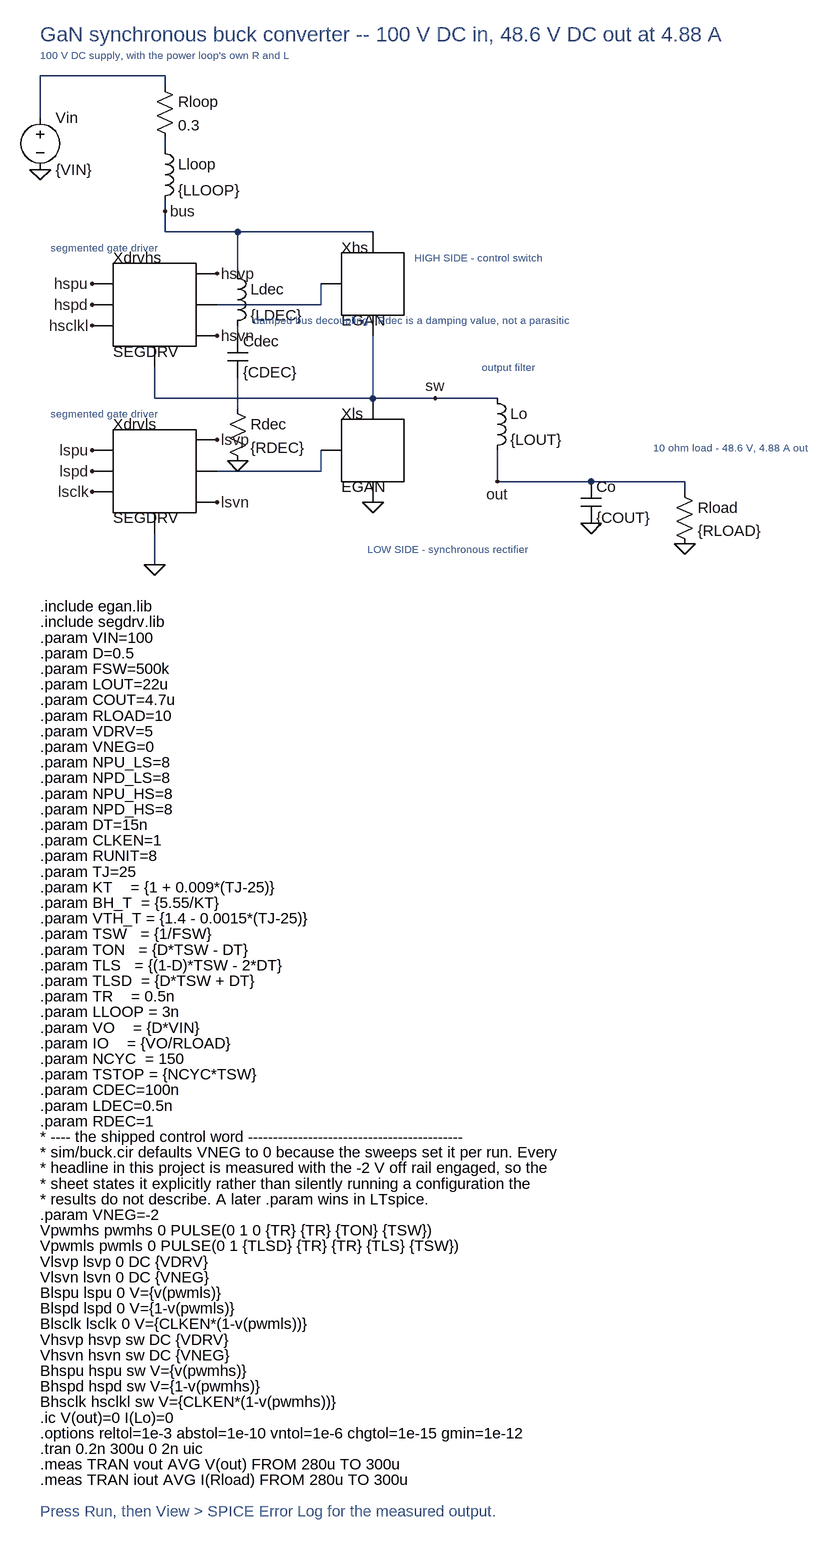
[diagram p0: schematic BUCK_converter.asc]
BUCK_converter.asc, the LTspice schematic file:
Version 4
SHEET 1 2100 1400
SYMBOL voltage 96 192 R0
SYMATTR InstName Vin
SYMATTR Value {VIN}
FLAG 96 288 0
WIRE 96 208 96 144
WIRE 96 144 288 144
SYMBOL res 272 144 R0
SYMATTR InstName Rloop
SYMATTR Value 0.3
WIRE 288 144 288 160
SYMBOL ind 272 240 R0
SYMATTR InstName Lloop
SYMATTR Value {LLOOP}
WIRE 288 240 288 256
WIRE 288 336 288 384
FLAG 288 352 bus
SYMBOL ind 384 432 R0
SYMATTR InstName Ldec
SYMATTR Value {LDEC}
WIRE 400 384 400 448
SYMBOL cap 384 544 R0
SYMATTR InstName Cdec
SYMATTR Value {CDEC}
WIRE 400 528 400 544
SYMBOL res 384 640 R0
SYMATTR InstName Rdec
SYMATTR Value {RDEC}
WIRE 400 608 400 656
FLAG 400 736 0
TEXT 424 520 Left 1 ;damped bus decoupling - Rdec is a damping value, not a parasitic
SYMBOL egan 560 416 R0
SYMATTR InstName Xhs
WIRE 288 384 608 384
WIRE 608 544 608 640
SYMBOL egan 560 672 R0
SYMATTR InstName Xls
WIRE 608 640 608 640
FLAG 608 800 0
WIRE 608 640 800 640
FLAG 704 640 sw
SYMBOL ind 784 624 R0
SYMATTR InstName Lo
SYMATTR Value {LOUT}
WIRE 800 720 800 768
WIRE 800 768 1088 768
FLAG 800 768 out
SYMBOL cap 928 768 R0
SYMATTR InstName Co
SYMATTR Value {COUT}
FLAG 944 832 0
SYMBOL res 1072 768 R0
SYMATTR InstName Rload
SYMATTR Value {RLOAD}
WIRE 1088 768 1088 784
FLAG 1088 864 0
SYMBOL segdrv 208 432 R0
SYMATTR InstName Xdrvhs
SYMATTR Value2 npu={NPU_HS} npd={NPD_HS} runit={RUNIT} rclamp=0.5
WIRE 368 496 528 496
WIRE 528 496 528 464
FLAG 176 464 hspu
FLAG 176 496 hspd
FLAG 176 528 hsclkl
FLAG 368 448 hsvp
FLAG 368 544 hsvn
WIRE 272 592 272 640
WIRE 272 640 608 640
SYMBOL segdrv 208 688 R0
SYMATTR InstName Xdrvls
SYMATTR Value2 npu={NPU_LS} npd={NPD_LS} runit={RUNIT} rclamp=0.5
WIRE 368 752 528 752
WIRE 528 752 528 720
FLAG 176 720 lspu
FLAG 176 752 lspd
FLAG 176 784 lsclk
FLAG 368 704 lsvp
FLAG 368 800 lsvn
WIRE 272 848 272 896
FLAG 272 896 0
TEXT 96 80 Left 3 ;GaN synchronous buck converter -- 100 V DC in, 48.6 V DC out at 4.88 A
TEXT 96 112 Left 1 ;100 V DC supply, with the power loop's own R and L
TEXT 672 424 Left 1 ;HIGH SIDE - control switch
TEXT 600 872 Left 1 ;LOW SIDE - synchronous rectifier
TEXT 776 592 Left 1 ;output filter
TEXT 1040 716 Left 1 ;10 ohm load - 48.6 V, 4.88 A out
TEXT 112 408 Left 1 ;segmented gate driver
TEXT 112 664 Left 1 ;segmented gate driver
TEXT 96 960 Left 2 !.include egan.lib
TEXT 96 984 Left 2 !.include segdrv.lib
TEXT 96 1008 Left 2 !.param VIN=100
TEXT 96 1032 Left 2 !.param D=0.5
TEXT 96 1056 Left 2 !.param FSW=500k
TEXT 96 1080 Left 2 !.param LOUT=22u
TEXT 96 1104 Left 2 !.param COUT=4.7u
TEXT 96 1128 Left 2 !.param RLOAD=10
TEXT 96 1152 Left 2 !.param VDRV=5
TEXT 96 1176 Left 2 !.param VNEG=0
TEXT 96 1200 Left 2 !.param NPU_LS=8
TEXT 96 1224 Left 2 !.param NPD_LS=8
TEXT 96 1248 Left 2 !.param NPU_HS=8
TEXT 96 1272 Left 2 !.param NPD_HS=8
TEXT 96 1296 Left 2 !.param DT=15n
TEXT 96 1320 Left 2 !.param CLKEN=1
TEXT 96 1344 Left 2 !.param RUNIT=8
TEXT 96 1368 Left 2 !.param TJ=25
TEXT 96 1392 Left 2 !.param KT    = {1 + 0.009*(TJ-25)}
TEXT 96 1416 Left 2 !.param BH_T  = {5.55/KT}
TEXT 96 1440 Left 2 !.param VTH_T = {1.4 - 0.0015*(TJ-25)}
TEXT 96 1464 Left 2 !.param TSW   = {1/FSW}
TEXT 96 1488 Left 2 !.param TON   = {D*TSW - DT}
TEXT 96 1512 Left 2 !.param TLS   = {(1-D)*TSW - 2*DT}
TEXT 96 1536 Left 2 !.param TLSD  = {D*TSW + DT}
TEXT 96 1560 Left 2 !.param TR    = 0.5n
TEXT 96 1584 Left 2 !.param LLOOP = 3n
TEXT 96 1608 Left 2 !.param VO    = {D*VIN}
TEXT 96 1632 Left 2 !.param IO    = {VO/RLOAD}
TEXT 96 1656 Left 2 !.param NCYC  = 150
TEXT 96 1680 Left 2 !.param TSTOP = {NCYC*TSW}
TEXT 96 1704 Left 2 !.param CDEC=100n
TEXT 96 1728 Left 2 !.param LDEC=0.5n
TEXT 96 1752 Left 2 !.param RDEC=1
TEXT 96 1776 Left 2 !* ---- the shipped control word -------------------------------------------
TEXT 96 1800 Left 2 !* sim/buck.cir defaults VNEG to 0 because the sweeps set it per run. Every
TEXT 96 1824 Left 2 !* headline in this project is measured with the -2 V off rail engaged, so the
TEXT 96 1848 Left 2 !* sheet states it explicitly rather than silently running a configuration the
TEXT 96 1872 Left 2 !* results do not describe. A later .param wins in LTspice.
TEXT 96 1896 Left 2 !.param VNEG=-2
TEXT 96 1920 Left 2 !Vpwmhs pwmhs 0 PULSE(0 1 0 {TR} {TR} {TON} {TSW})
TEXT 96 1944 Left 2 !Vpwmls pwmls 0 PULSE(0 1 {TLSD} {TR} {TR} {TLS} {TSW})
TEXT 96 1968 Left 2 !Vlsvp lsvp 0 DC {VDRV}
TEXT 96 1992 Left 2 !Vlsvn lsvn 0 DC {VNEG}
TEXT 96 2016 Left 2 !Blspu lspu 0 V={v(pwmls)}
TEXT 96 2040 Left 2 !Blspd lspd 0 V={1-v(pwmls)}
TEXT 96 2064 Left 2 !Blsclk lsclk 0 V={CLKEN*(1-v(pwmls))}
TEXT 96 2088 Left 2 !Vhsvp hsvp sw DC {VDRV}
TEXT 96 2112 Left 2 !Vhsvn hsvn sw DC {VNEG}
TEXT 96 2136 Left 2 !Bhspu hspu sw V={v(pwmhs)}
TEXT 96 2160 Left 2 !Bhspd hspd sw V={1-v(pwmhs)}
TEXT 96 2184 Left 2 !Bhsclk hsclkl sw V={CLKEN*(1-v(pwmhs))}
TEXT 96 2208 Left 2 !.ic V(out)=0 I(Lo)=0
TEXT 96 2232 Left 2 !.options reltol=1e-3 abstol=1e-10 vntol=1e-6 chgtol=1e-15 gmin=1e-12
TEXT 96 2256 Left 2 !.tran 0.2n 300u 0 2n uic
TEXT 96 2280 Left 2 !.meas TRAN vout AVG V(out) FROM 280u TO 300u
TEXT 96 2304 Left 2 !.meas TRAN iout AVG I(Rload) FROM 280u TO 300u
TEXT 96 2352 Left 2 ;Press Run, then View > SPICE Error Log for the measured output.

The netlist it stands for:
* BUCK_converter.asc
Vin N001 0 {VIN}
Rloop N001 N002 0.3
Lloop N002 bus {LLOOP}
Ldec bus N003 {LDEC}
Cdec N003 N004 {CDEC}
Rdec N004 0 {RDEC}
XXhs bus N005 sw EGAN  ; pins d g s
XXls sw N006 0 EGAN  ; pins d g s
Lo sw out {LOUT}
Co out 0 {COUT}
Rload out 0 {RLOAD}
XXdrvhs hspu hspd hsclkl N005 hsvp hsvn sw SEGDRV npu={NPU_HS} npd={NPD_HS} runit={RUNIT} rclamp=0.5  ; pins pu pd clk out vp vn ref
XXdrvls lspu lspd lsclk N006 lsvp lsvn 0 SEGDRV npu={NPU_LS} npd={NPD_LS} runit={RUNIT} rclamp=0.5  ; pins pu pd clk out vp vn ref
* damped bus decoupling - Rdec is a damping value, not a parasitic
* GaN synchronous buck converter -- 100 V DC in, 48.6 V DC out at 4.88 A
* 100 V DC supply, with the power loop's own R and L
* HIGH SIDE - control switch
* LOW SIDE - synchronous rectifier
* output filter
* 10 ohm load - 48.6 V, 4.88 A out
* segmented gate driver
* segmented gate driver
.include egan.lib
.include segdrv.lib
.param VIN=100
.param D=0.5
.param FSW=500k
.param LOUT=22u
.param COUT=4.7u
.param RLOAD=10
.param VDRV=5
.param VNEG=0
.param NPU_LS=8
.param NPD_LS=8
.param NPU_HS=8
.param NPD_HS=8
.param DT=15n
.param CLKEN=1
.param RUNIT=8
.param TJ=25
.param KT    = {1 + 0.009*(TJ-25)}
.param BH_T  = {5.55/KT}
.param VTH_T = {1.4 - 0.0015*(TJ-25)}
.param TSW   = {1/FSW}
.param TON   = {D*TSW - DT}
.param TLS   = {(1-D)*TSW - 2*DT}
.param TLSD  = {D*TSW + DT}
.param TR    = 0.5n
.param LLOOP = 3n
.param VO    = {D*VIN}
.param IO    = {VO/RLOAD}
.param NCYC  = 150
.param TSTOP = {NCYC*TSW}
.param CDEC=100n
.param LDEC=0.5n
.param RDEC=1
* ---- the shipped control word -------------------------------------------
* sim/buck.cir defaults VNEG to 0 because the sweeps set it per run. Every
* headline in this project is measured with the -2 V off rail engaged, so the
* sheet states it explicitly rather than silently running a configuration the
* results do not describe. A later .param wins in LTspice.
.param VNEG=-2
Vpwmhs pwmhs 0 PULSE(0 1 0 {TR} {TR} {TON} {TSW})
Vpwmls pwmls 0 PULSE(0 1 {TLSD} {TR} {TR} {TLS} {TSW})
Vlsvp lsvp 0 DC {VDRV}
Vlsvn lsvn 0 DC {VNEG}
Blspu lspu 0 V={v(pwmls)}
Blspd lspd 0 V={1-v(pwmls)}
Blsclk lsclk 0 V={CLKEN*(1-v(pwmls))}
Vhsvp hsvp sw DC {VDRV}
Vhsvn hsvn sw DC {VNEG}
Bhspu hspu sw V={v(pwmhs)}
Bhspd hspd sw V={1-v(pwmhs)}
Bhsclk hsclkl sw V={CLKEN*(1-v(pwmhs))}
.ic V(out)=0 I(Lo)=0
.options reltol=1e-3 abstol=1e-10 vntol=1e-6 chgtol=1e-15 gmin=1e-12
.tran 0.2n 300u 0 2n uic
.meas TRAN vout AVG V(out) FROM 280u TO 300u
.meas TRAN iout AVG I(Rload) FROM 280u TO 300u
* Press Run, then View > SPICE Error Log for the measured output.
.backanno
.end